# EAGLE board final_schematic (EAGLE 9.2.2), part 1 of 2
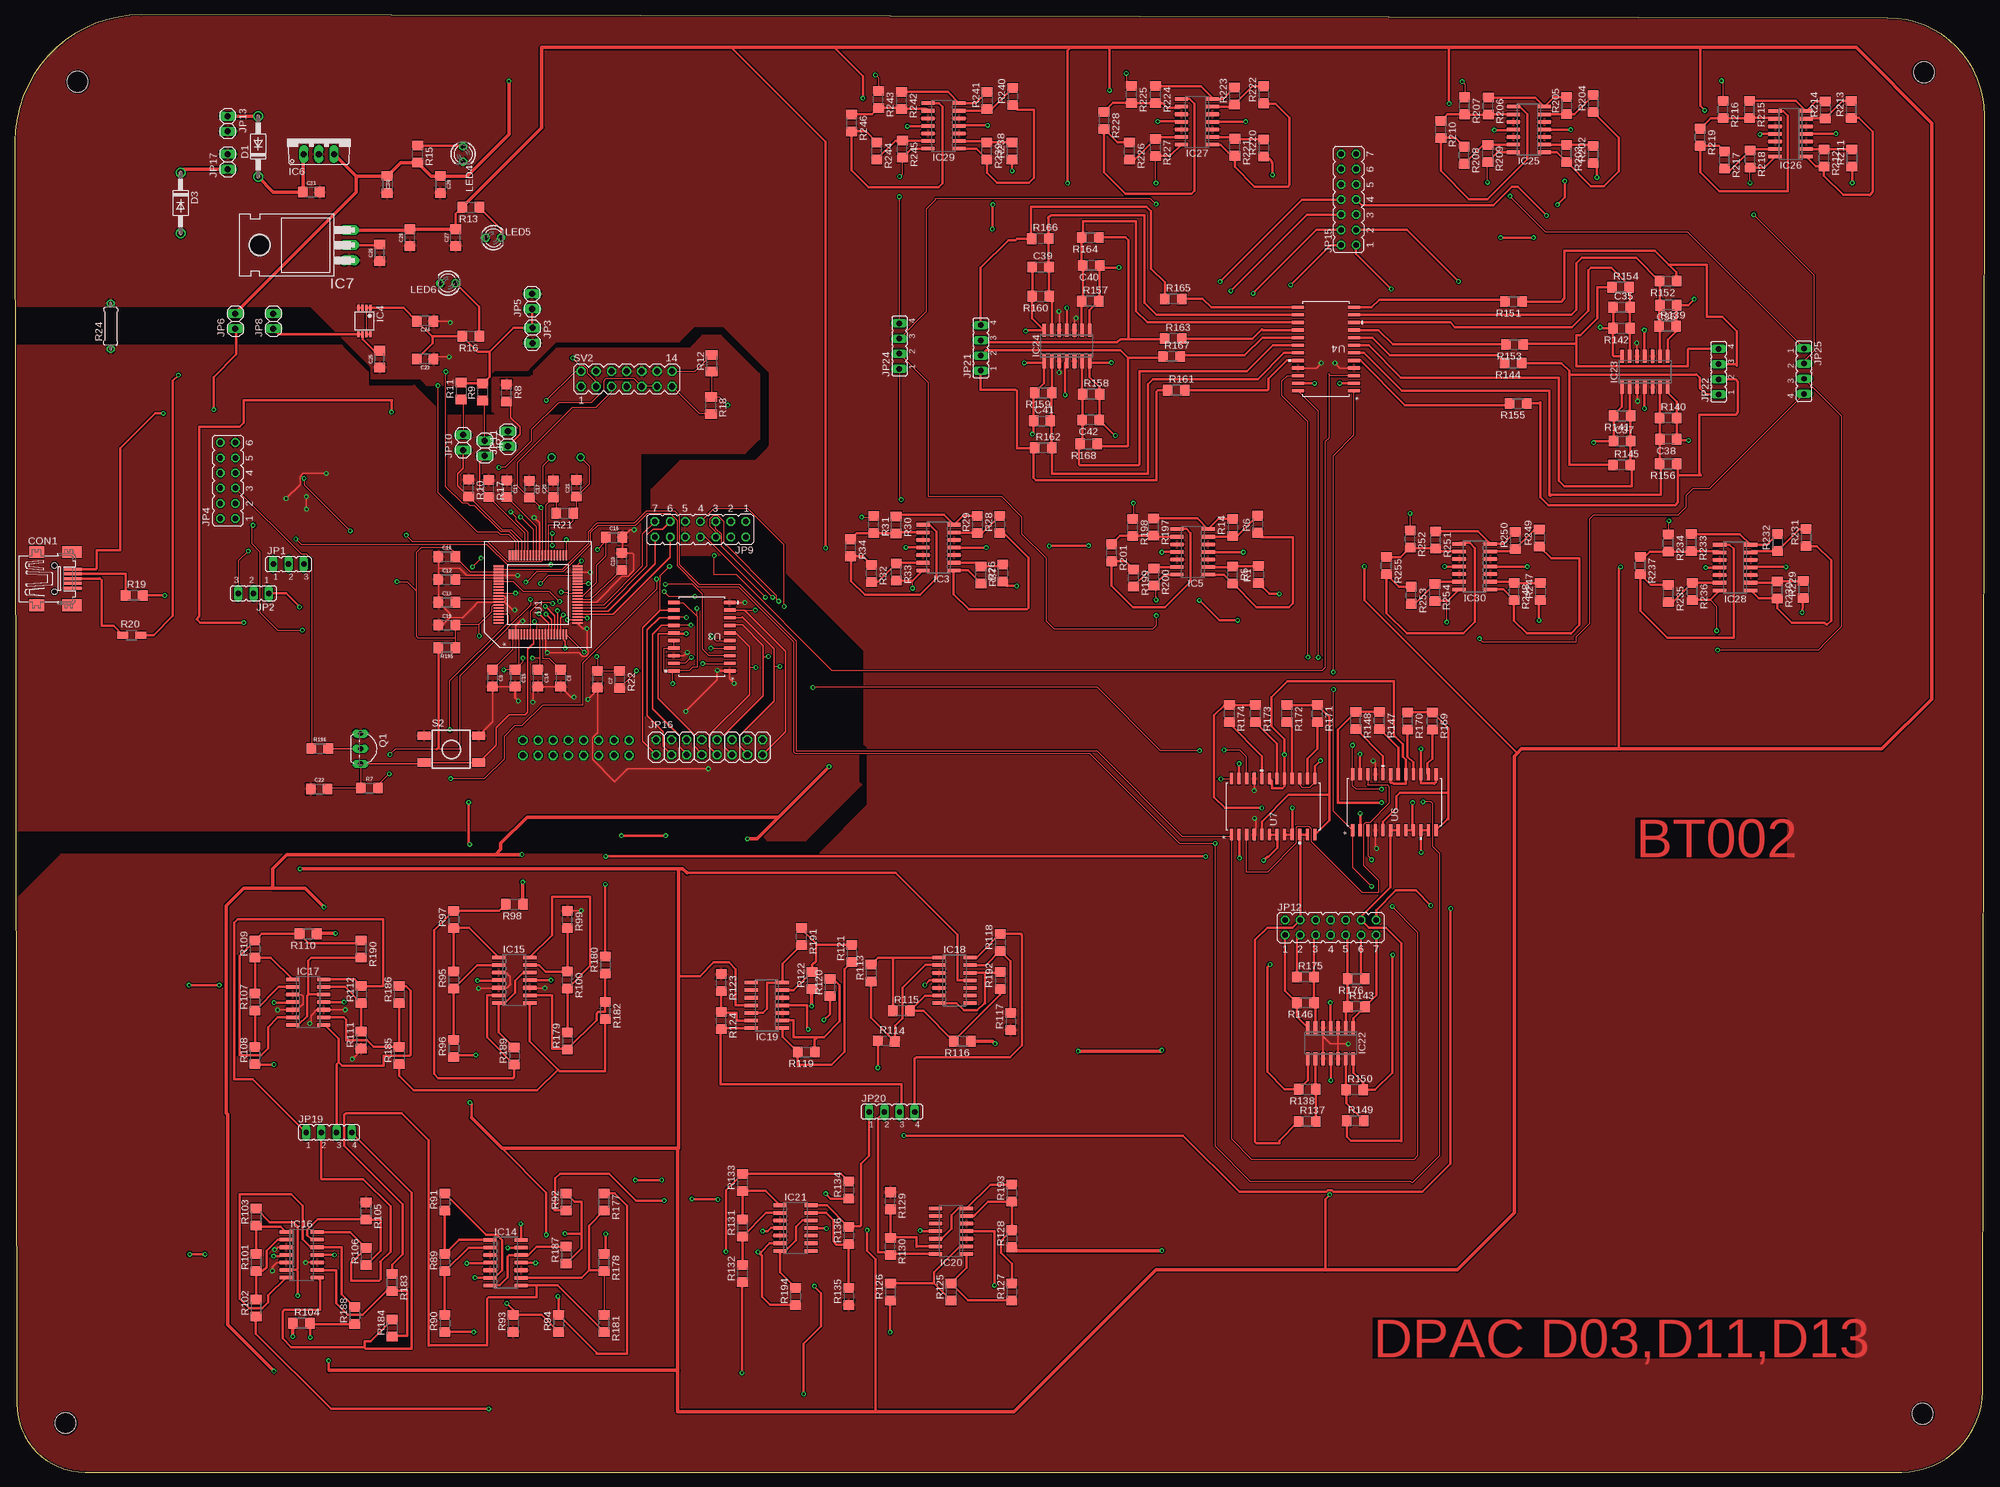
[diagram p3: board, top side]
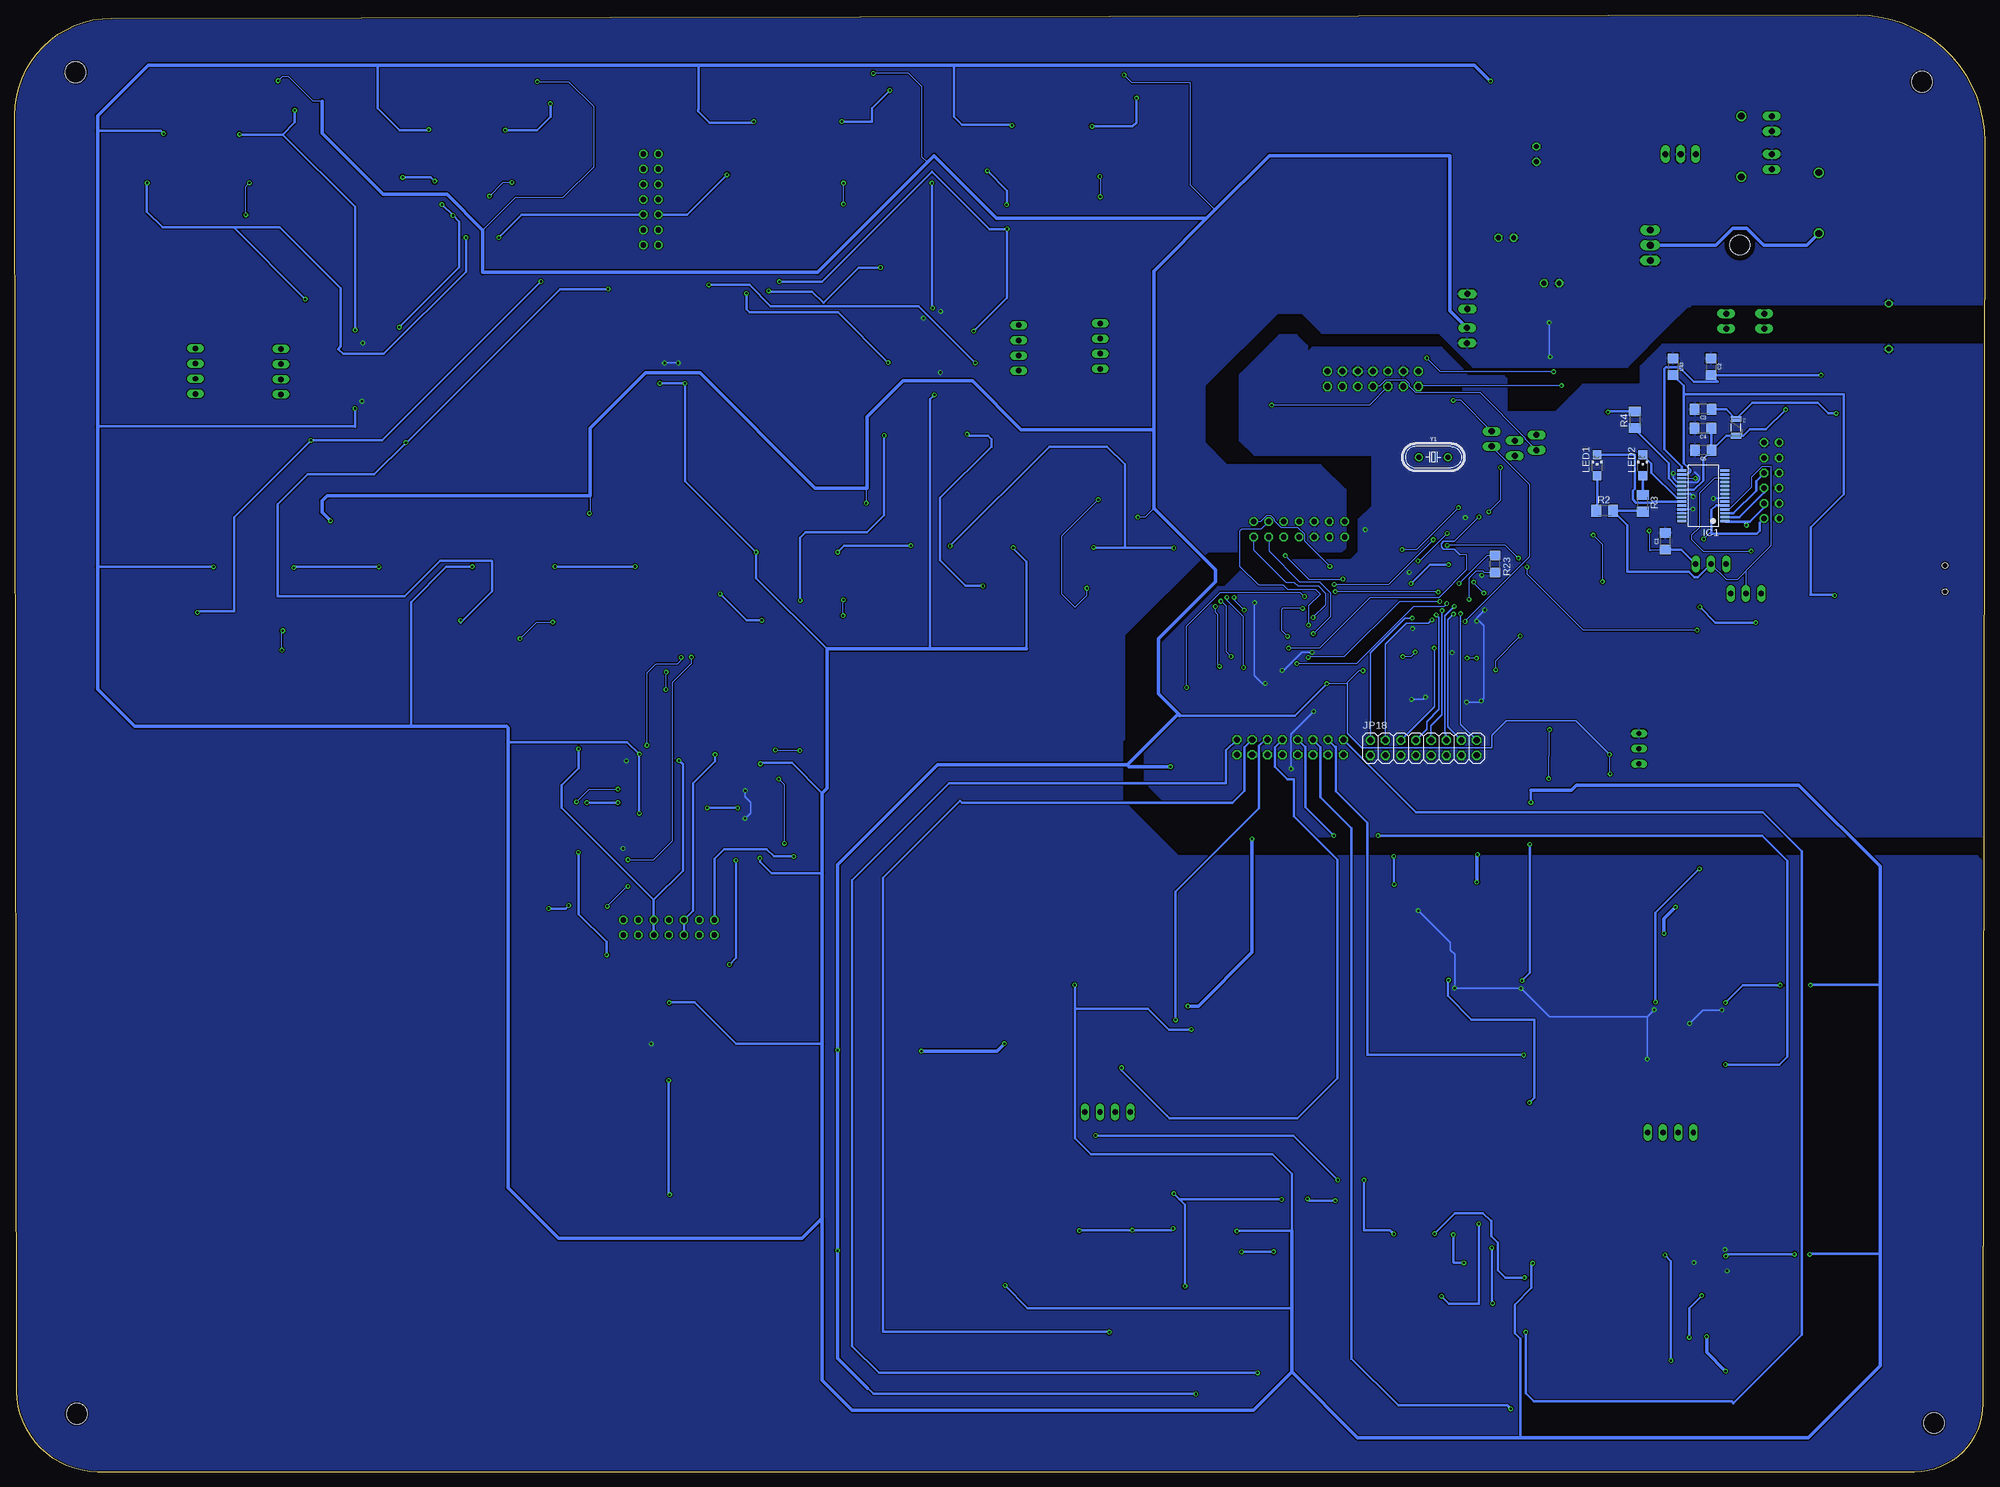
[diagram p4: board, bottom side, seen from below]

Size 329.54 x 243.72 mm. Coordinates in mm from the lower left corner, seen from the top.
Outline: 0,222.55 0.3,11.42 arc90 11.73,0 315.67,0 arc89 329.23,13.55 329.54,226.97 arc90 313.35,243.21 21.18,243.72 arc90 0,222.55
Copper layers (1*16): Top 0.035mm / dielectric 1.5mm / Bottom 0.035mm
Design rules "default *": minimum track width 8mil, minimum drill 0.35mm, track to track 7mil, track to pad 7mil, pad to pad 7mil, via to via 7mil, smd to smd 7mil, copper to edge 10mil, drill to drill 7mil, minimum pad ring 10mil, minimum via ring 8mil, stop-mask expansion 4mil, vias tented up to drill 0mil, thermal gap 10mil
Net classes: 0 default: width 0.203 mm; 1 power: width 0.254 mm
Holes 3.5 mm at 10.48,232.56 319.39,234.14 319.18,9.75 8.47,8.18

## Footprints (pad centres in the part's own frame; a part is rotated, then mirrored left to right if it is on the bottom)
1206 = smd 1.6 x 1.8: 1 -1.4,0; 2 1.4,0
C1206 = smd 1.6 x 1.8: 1 -1.4,0; 2 1.4,0
32005-201 = smd 3.1 x 0.5: 1 3,1.6; 2 3,0.8; 3 3,0; 4 3,-0.8; 5 3,-1.6 | smd 2.5 x 2: M1 -3,-4.45; M2 -3,4.45 | smd 3.3 x 2: M3 2.9,4.45; M4 2.9,-4.45 | hole 0.9: 0,2.2; 0,-2.2
DO41-10 = drill 1.118: A 5.08,0; C -5.08,0
PTC-1206 = smd 1 x 1.8: 1 -1.4,0; 2 1.4,0
SSOP28 = smd 0.4 x 1.5: 1 -4.225,-3.625; 2 -3.575,-3.625; 3 -2.925,-3.625; 4 -2.275,-3.625; 5 -1.625,-3.625; 6 -0.975,-3.625; 7 -0.325,-3.625; 8 0.325,-3.625; 9 0.975,-3.625; 10 1.625,-3.625; 11 2.275,-3.625; 12 2.925,-3.625; 13 3.575,-3.625; 14 4.225,-3.625; 15 4.225,3.625; 16 3.575,3.625; 17 2.925,3.625; 18 2.275,3.625; 19 1.625,3.625; 20 0.975,3.625; 21 0.325,3.625; 22 -0.325,3.625; 23 -0.975,3.625; 24 -1.625,3.625; 25 -2.275,3.625; 26 -2.925,3.625; 27 -3.575,3.625; 28 -4.225,3.625
SO14 = smd 0.6 x 2.2: 1 -3.81,-2.6; 2 -2.54,-2.6; 3 -1.27,-2.6; 4 0,-2.6; 5 1.27,-2.6; 6 2.54,-2.6; 7 3.81,-2.6; 8 3.81,2.6; 9 2.54,2.6; 10 1.27,2.6; 11 0,2.6; 12 -1.27,2.6; 13 -2.54,2.6; 14 -3.81,2.6
DGK_S-PDSO-G8 = smd 0.4 x 1: 1 -0.975,-2.2; 2 -0.325,-2.2; 3 0.325,-2.2; 4 0.975,-2.2; 5 0.975,2.2; 6 0.325,2.2; 7 -0.325,2.2; 8 -0.975,2.2
TO220V = drill 1.016 long: 1 -2.54,-2.54; 2 0,-2.54; 3 2.54,-2.54
TO220H = drill 1.118 long: 1 -2.54,-10.16; 2 0,-10.16; 3 2.54,-10.16 | hole 3.302: 0,4.826
JP2 = drill 0.914 long: 1 -2.54,0; 2 0,0; 3 2.54,0
1X02 = drill 1.016 long: 1 -1.27,0; 2 1.27,0
JP6Q = drill 0.914 octagon: 1 -6.35,-1.27; 2 -6.35,1.27; 3 -3.81,-1.27; 4 -3.81,1.27; 5 -1.27,-1.27; 6 -1.27,1.27; 7 1.27,-1.27; 8 1.27,1.27; 9 3.81,-1.27; 10 3.81,1.27; 11 6.35,-1.27; 12 6.35,1.27
JP7Q = drill 0.914 octagon: 1 -7.62,-1.27; 2 -7.62,1.27; 3 -5.08,-1.27; 4 -5.08,1.27; 5 -2.54,-1.27; 6 -2.54,1.27; 7 0,-1.27; 8 0,1.27; 9 2.54,-1.27; 10 2.54,1.27; 11 5.08,-1.27; 12 5.08,1.27; 13 7.62,-1.27; 14 7.62,1.27
2X08 = drill 1.016 octagon: 1 -8.89,-1.27; 2 -8.89,1.27; 3 -6.35,-1.27; 4 -6.35,1.27; 5 -3.81,-1.27; 6 -3.81,1.27; 7 -1.27,-1.27; 8 -1.27,1.27; 9 1.27,-1.27; 10 1.27,1.27; 11 3.81,-1.27; 12 3.81,1.27; 13 6.35,-1.27; 14 6.35,1.27; 15 8.89,-1.27; 16 8.89,1.27
JP4 = drill 0.914 long: 1 -3.81,0; 2 -1.27,0; 3 1.27,0; 4 3.81,0
CHIPLED_1206 = smd 1.5 x 1.5: A 0,-1.75; C 0,1.75
LED3MM = drill 0.813 octagon: A -1.27,0; K 1.27,0
TO92-EBC = drill 0.813 long: B 0,-1.27; C -2.54,-1.27; E 2.54,-1.27
R1206 = smd 1.6 x 1.803: 1 -1.422,0; 2 1.422,0
M1206 = smd 1.6 x 2: 1 -1.4,0; 2 1.4,0
R1206W = smd 1.8 x 1.2: 1 -1.499,0; 2 1.499,0
0207/7 = drill 0.813 octagon: 1 -3.81,0; 2 3.81,0
FSMJSMA = smd 1.397 x 2.108: P$1 0,0; P$2 0,-9.119; P$3 4.496,0; P$4 4.496,-9.119
MA07-2 = drill 1.016 octagon: 1 -7.62,-1.27; 2 -7.62,1.27; 3 -5.08,-1.27; 4 -5.08,1.27; 5 -2.54,-1.27; 6 -2.54,1.27; 7 0,-1.27; 8 0,1.27; 9 2.54,-1.27; 10 2.54,1.27; 11 5.08,-1.27; 12 5.08,1.27; 13 7.62,-1.27; 14 7.62,1.27
PN80 = smd 1.676 x 0.279: 1 -6.617,4.75; 2 -6.617,4.25; 3 -6.617,3.75; 4 -6.617,3.25; 5 -6.617,2.75; 6 -6.617,2.25; 7 -6.617,1.75; 8 -6.617,1.25; 9 -6.617,0.75; 10 -6.617,0.25; 11 -6.617,-0.25; 12 -6.617,-0.75; 13 -6.617,-1.25; 14 -6.617,-1.75; 15 -6.617,-2.25; 16 -6.617,-2.75; 17 -6.617,-3.25; 18 -6.617,-3.75; 19 -6.617,-4.25; 20 -6.617,-4.75; 41 6.617,-4.75; 42 6.617,-4.25; 43 6.617,-3.75; 44 6.617,-3.25; 45 6.617,-2.75; 46 6.617,-2.25; 47 6.617,-1.75; 48 6.617,-1.25; 49 6.617,-0.75; 50 6.617,-0.25; 51 6.617,0.25; 52 6.617,0.75; 53 6.617,1.25; 54 6.617,1.75; 55 6.617,2.25; 56 6.617,2.75; 57 6.617,3.25; 58 6.617,3.75; 59 6.617,4.25; 60 6.617,4.75 | smd 0.279 x 1.676: 21 -4.75,-6.617; 22 -4.25,-6.617; 23 -3.75,-6.617; 24 -3.25,-6.617; 25 -2.75,-6.617; 26 -2.25,-6.617; 27 -1.75,-6.617; 28 -1.25,-6.617; 29 -0.75,-6.617; 30 -0.25,-6.617; 31 0.25,-6.617; 32 0.75,-6.617; 33 1.25,-6.617; 34 1.75,-6.617; 35 2.25,-6.617; 36 2.75,-6.617; 37 3.25,-6.617; 38 3.75,-6.617; 39 4.25,-6.617; 40 4.75,-6.617; 61 4.75,6.617; 62 4.25,6.617; 63 3.75,6.617; 64 3.25,6.617; 65 2.75,6.617; 66 2.25,6.617; 67 1.75,6.617; 68 1.25,6.617; 69 0.75,6.617; 70 0.25,6.617; 71 -0.25,6.617; 72 -0.75,6.617; 73 -1.25,6.617; 74 -1.75,6.617; 75 -2.25,6.617; 76 -2.75,6.617; 77 -3.25,6.617; 78 -3.75,6.617; 79 -4.25,6.617; 80 -4.75,6.617
DW20 = smd 1.981 x 0.559: 1 -4.686,5.715; 2 -4.686,4.445; 3 -4.686,3.175; 4 -4.686,1.905; 5 -4.686,0.635; 6 -4.686,-0.635; 7 -4.686,-1.905; 8 -4.686,-3.175; 9 -4.686,-4.445; 10 -4.686,-5.715; 11 4.686,-5.715; 12 4.686,-4.445; 13 4.686,-3.175; 14 4.686,-1.905; 15 4.686,-0.635; 16 4.686,0.635; 17 4.686,1.905; 18 4.686,3.175; 19 4.686,4.445; 20 4.686,5.715
21-0042B_24 = smd 1.981 x 0.533: 1 -4.686,6.985; 2 -4.686,5.715; 3 -4.686,4.445; 4 -4.686,3.175; 5 -4.686,1.905; 6 -4.686,0.635; 7 -4.686,-0.635; 8 -4.686,-1.905; 9 -4.686,-3.175; 10 -4.686,-4.445; 11 -4.686,-5.715; 12 -4.686,-6.985; 13 4.686,-6.985; 14 4.686,-5.715; 15 4.686,-4.445; 16 4.686,-3.175; 17 4.686,-1.905; 18 4.686,-0.635; 19 4.686,0.635; 20 4.686,1.905; 21 4.686,3.175; 22 4.686,4.445; 23 4.686,5.715; 24 4.686,6.985
HC49U = drill 0.813: 1 -2.413,0; 2 2.413,0

## Placement (x,y rotation side)
C1  1.0uF  [1206]  53.39,155.68 90 bottom
C2  1.0uF  [1206]  45.77,184.89 270 bottom
C3  1.0uF  [1206]  47.08,177.79 180 bottom
C4  1.0uF  [1206]  47.11,174.58 180 bottom
C5  1.0uF  [1206]  47.04,170.92 180 bottom
C7  2.2uF  [1206]  97.46,132.61 270 top
C8  2.2uF  [1206]  91.32,132.79 270 top
C9  2.2uF  [1206]  79.89,132.79 270 top
C10  2.2uF  [1206]  101.54,152.3 90 top
C11  2.2uF  [1206]  82.32,164.46 270 top
C12  2.2uF  [1206]  72.27,149.3 0 top
C13  2.2uF  [1206]  72.27,145.49 0 top
C14  2.2uF  [1206]  87.51,132.79 270 top
C15  2.2uF  [1206]  83.7,132.79 270 top
C16  2.2uF  [1206]  100.24,156.35 0 top
C17  2.2uF  [1206]  86.06,164.39 270 top
C18  2.2uF  [1206]  72.27,153.11 0 top
C19  2.2uF  [1206]  72.27,141.68 0 top
C20  2.2uF  [1206]  90.07,164.45 90 top
C21  2.2uF  [1206]  93.95,164.54 90 top
C22  1.0uF  [1206]  50.9,114.27 0 top
C23  1.0uF  [1206]  68.63,186.16 180 top
C24  1.0uF  [1206]  68.63,192.51 180 top
C25  1.0uF  [1206]  61.01,186.16 90 top
C26  1.0uF  [1206]  61.01,203.94 90 top
C27  1.0uF  [1206]  73.71,206.48 90 top
C28  1.0uF  [1206]  66.09,206.48 90 top
C29  1.0uF  [1206]  71.17,215.37 270 top
C30  1.0uF  [1206]  62.28,215.37 270 top
C31  1.0uF  [1206]  49.58,214.1 0 top
C35  [C1206]  268.83,194.84 0 top
C36  [C1206]  276.63,195.18 180 top
C37  [C1206]  268.91,172.45 0 top
C38  [C1206]  276.64,172.75 180 top
C39  [C1206]  171.61,201.57 0 top
C40  [C1206]  180.07,201.8 180 top
C41  [C1206]  171.84,175.82 0 top
C42  [C1206]  179.99,175.99 180 top
C43  1.0uF  [1206]  52.12,184.89 270 bottom
CON1  UBC05V128-B0C04D  [32005-201]  6.62,149.44 0 top
D1  1N4004  [DO41-10]  40.69,221.72 90 top
D3  1N4004  [DO41-10]  27.72,212.27 270 top
F2  500mA  [PTC-1206]  41.59,174.74 270 bottom
IC1  FT232RL  [SSOP28]  47.04,163.3 90 bottom
IC3  TL084D  [SO14]  154.53,154.64 90 top
IC4  TPS77333  [DGK_S-PDSO-G8]  58.47,192.51 180 top
IC5  TL084D  [SO14]  197.03,153.91 90 top
IC6  7812TV  [TO220V]  50.85,222.99 0 top
IC7  [TO220H]  45.77,205.21 90 top
IC14  TL084D  [SO14]  82.08,35.01 270 top
IC15  TL084D  [SO14]  83.54,82.27 270 top
IC16  TL084D  [SO14]  47.96,36.32 270 top
IC17  TL084D  [SO14]  49.06,78.59 270 top
IC18  TL084D  [SO14]  157.22,82.23 270 top
IC19  TL084D  [SO14]  125.8,78.05 90 top
IC20  TL084D  [SO14]  156.63,40.29 90 top
IC21  TL084D  [SO14]  130.61,40.81 270 top
IC22  TL084D  [SO14]  220.12,71.74 180 top
IC23  TL084D  [SO14]  272.7,184.03 0 top
IC24  TL084D  [SO14]  176.01,188.37 0 top
IC25  TL084D  [SO14]  253.28,224.57 90 top
IC26  TL084D  [SO14]  297.1,223.83 90 top
IC27  TL084D  [SO14]  197.77,225.84 90 top
IC28  TL084D  [SO14]  287.81,151.29 90 top
IC29  TL084D  [SO14]  155.36,225.16 90 top
IC30  TL084D  [SO14]  244.23,151.45 90 top
JP1  power select  [JP2]  45.77,151.87 0 top
JP2  TEST  [JP2]  39.93,146.99 180 top
JP3  [1X02]  86.59,190.11 270 top
JP4  [JP6Q]  35.61,165.84 90 top
JP5  [1X02]  86.52,195.81 90 top
JP6  [1X02]  36.88,192.51 90 top
JP7  [1X02]  78.62,171.26 270 top
JP8  [1X02]  43.23,192.51 90 top
JP9  [JP7Q]  114.69,157.68 180 top
JP10  [1X02]  74.96,172.21 90 top
JP11  [1X02]  82.48,172.82 90 top
JP12  [JP7Q]  220.13,91.08 0 top
JP13  [1X02]  35.61,225.53 270 top
JP15  [JP7Q]  223.12,212.85 90 top
JP16  [2X08]  116.19,121.25 0 top
JP17  [1X02]  35.61,219.18 90 top
JP18  [2X08]  93.87,121.13 0 bottom
JP19  [JP4]  52.54,56.79 0 top
JP20  [JP4]  146.73,60.25 0 top
JP21  [JP4]  161.58,188.02 90 top
JP22  [JP4]  285.03,184.05 90 top
JP24  [JP4]  147.99,188.33 90 top
JP25  [JP4]  299.35,184.14 270 top
LED1  TXLED  [CHIPLED_1206]  64.82,168.38 0 bottom
LED2  RXLED  [CHIPLED_1206]  57.2,168.38 0 bottom
LED4  [LED3MM]  74.98,220.45 270 top
LED5  [LED3MM]  80.06,206.48 0 top
LED6  [LED3MM]  72.44,198.86 180 top
Q1  BC558B  [TO92-EBC]  59.09,120.99 270 top
R1  [R1206]  208.05,150.12 90 top
R2  270Ohm  [M1206]  63.55,160.76 0 bottom
R3  270Ohm  [M1206]  57.2,162.03 270 bottom
R4  10k  [M1206]  58.47,176 90 bottom
R5  [R1206]  203.75,150.05 270 top
R6  [R1206]  207.92,158.54 90 top
R7  [1206]  59.31,114.43 0 top
R8  [R1206]  82.23,180.48 270 top
R9  [R1206]  78.25,180.66 90 top
R10  [R1206]  75.89,164.57 270 top
R11  [R1206]  74.65,180.81 90 top
R12  4.7K  [M1206]  116.59,185.48 90 top
R13  [R1206]  76.25,211.56 180 top
R14  [R1206]  203.73,157.99 90 top
R15  [R1206]  67.36,220.45 270 top
R16  [R1206]  76.25,189.97 180 top
R17  [R1206]  79.28,164.48 270 top
R18  4.7K  [M1206]  116.47,178.4 270 top
R19  0  [R1206]  19.95,146.63 0 top
R20  0  [R1206W]  19.54,139.98 0 top
R21  [R1206]  91.99,160.36 180 top
R22  [R1206]  101.18,132.54 270 top
R23  [R1206]  81.88,151.85 270 bottom
R24  [0207/7]  16.01,191.65 90 top
R26  [R1206]  165.27,150.36 90 top
R27  [R1206]  161.64,150.05 270 top
R28  [R1206]  164.79,158.53 90 top
R29  [R1206]  161,158.5 90 top
R30  [R1206]  147.44,158.41 270 top
R31  [R1206]  143.7,158.46 270 top
R32  [R1206]  143.31,150.31 270 top
R33  [R1206]  147.45,150.54 270 top
R34  [R1206]  139.83,154.6 270 top
R89  [R1206]  71.92,35.01 90 top
R90  [R1206]  71.92,24.85 90 top
R91  [R1206]  71.92,45.17 90 top
R92  [R1206]  92.24,45.17 90 top
R93  [R1206]  83.35,24.85 90 top
R94  [R1206]  90.97,24.85 90 top
R95  [R1206]  73.38,82.27 90 top
R96  [R1206]  73.38,70.84 90 top
R97  [R1206]  73.38,92.43 90 top
R98  [R1206]  83.54,94.97 180 top
R99  [R1206]  92.43,92.43 270 top
R100  [R1206]  92.43,82.27 270 top
R101  [R1206]  40.34,35.05 90 top
R102  [R1206]  40.34,27.43 90 top
R103  [R1206]  40.34,42.67 90 top
R104  [R1206]  47.96,24.89 0 top
R105  [R1206]  58.75,43.66 270 top
R106  [R1206]  58.75,36.04 90 top
R107  [R1206]  40.17,78.59 90 top
R108  [R1206]  40.17,69.7 90 top
R109  [R1206]  40.17,87.48 90 top
R110  [R1206]  49.06,90.02 180 top
R111  [R1206]  57.95,72.24 90 top
R112  [R1206]  57.95,79.86 90 top
R113  [R1206]  143.25,83.5 90 top
R114  [R1206]  145.79,72.07 357.4 top
R115  [R1206]  148.33,77.15 0 top
R116  [R1206]  158.49,72.07 180 top
R117  [R1206]  166.59,75.34 90 top
R118  [R1206]  164.84,88.58 90 top
R119  [R1206]  132.38,70.27 180 top
R120  [R1206]  136.36,81.04 90 top
R121  [R1206]  140.02,86.73 90 top
R122  [R1206]  133.37,82.24 90 top
R123  [R1206]  118.18,81.86 270 top
R124  [R1206]  118.18,75.51 270 top
R125  [R1206]  156.63,30.13 90 top
R126  [R1206]  146.47,30.13 90 top
R127  [R1206]  166.79,30.13 90 top
R128  [R1206]  166.79,39.02 90 top
R129  [R1206]  146.47,45.37 270 top
R130  [R1206]  146.47,37.75 270 top
R131  [R1206]  121.72,40.81 90 top
R132  [R1206]  121.72,33.19 90 top
R133  [R1206]  121.72,48.43 90 top
R134  [R1206]  139.5,47.16 90 top
R135  [R1206]  139.5,29.38 90 top
R136  [R1206]  139.5,39.54 90 top
R137  [R1206]  216.2,58.65 0 top
R138  [R1206]  216.21,64.03 180 top
R139  [R1206]  276.51,191.65 0 top
R140  [R1206]  276.59,176.32 0 top
R141  [R1206]  268.87,176.7 180 top
R142  [R1206]  268.8,191.32 180 top
R143  [R1206]  224.44,77.85 0 top
R144  [R1206]  250.63,185.49 180 top
R145  [R1206]  268.81,168.44 0 top
R146  [R1206]  215.92,78.51 180 top
R147  [R1206]  228.3,125.71 270 top
R148  [R1206]  224.34,125.71 270 top
R149  [R1206]  224.25,58.74 0 top
R150  [R1206]  224.16,63.93 0 top
R151  [R1206]  250.73,195.78 180 top
R152  [R1206]  276.57,199.22 180 top
R153  [R1206]  250.89,188.6 180 top
R154  [R1206]  268.64,198.18 0 top
R155  [R1206]  251.49,178.75 180 top
R156  [R1206]  276.57,168.64 180 top
R157  [R1206]  179.89,195.82 0 top
R158  [R1206]  180.04,180.29 0 top
R159  [R1206]  172.03,180.55 180 top
R160  [R1206]  171.62,196.66 180 top
R161  [R1206]  194.3,180.96 0 top
R162  [R1206]  172.01,171.31 0 top
R163  [R1206]  193.76,189.6 0 top
R164  [R1206]  179.91,206.5 180 top
R165  [R1206]  193.8,196.21 0 top
R166  [R1206]  171.53,206.31 0.5 top
R167  [R1206]  193.53,186.6 0 top
R168  [R1206]  179.67,171.98 180 top
R169  [R1206]  237.15,125.65 270 top
R170  [R1206]  233,125.64 270 top
R171  [R1206]  217.9,126.85 270 top
R172  [R1206]  212.82,126.85 270 top
R173  [R1206]  207.55,126.85 270 top
R174  [R1206]  203.19,126.85 270 top
R175  [R1206]  215.92,82.81 0 top
R176  [R1206]  224.37,82.52 180 top
R177  [R1206]  98.59,45.17 270 top
R178  [R1206]  98.59,35.01 270 top
R179  [R1206]  92.43,72.11 90 top
R180  [R1206]  98.78,84.81 90 top
R181  [R1206]  98.59,24.85 270 top
R182  [R1206]  98.78,77.19 270 top
R183  [R1206]  63.12,31.71 270 top
R184  [R1206]  63.12,24.09 90 top
R185  [R1206]  64.3,69.7 90 top
R186  [R1206]  64.3,79.86 90 top
R187  [R1206]  92.24,36.28 90 top
R188  [R1206]  56.85,26.16 90 top
R189  [R1206]  83.54,69.57 90 top
R190  [R1206]  57.95,87.48 270 top
R191  [R1206]  131.59,89.58 270 top
R192  [R1206]  164.84,82.23 90 top
R193  [R1206]  166.79,46.64 90 top
R194  [R1206]  130.61,29.38 90 top
R195  [1206]  72.27,137.87 180 top
R196  [1206]  51.01,121.04 0 top
R197  [R1206]  190.5,158.05 270 top
R198  [R1206]  187,158 270 top
R199  [R1206]  187.15,149.58 270 top
R200  [R1206]  190.56,149.71 270 top
R201  [R1206]  183.49,153.76 270 top
R202  [R1206]  264.03,220.37 90 top
R203  [R1206]  259.63,220.56 270 top
R204  [R1206]  264.06,228.89 90 top
R205  [R1206]  259.63,228.55 90 top
R206  [R1206]  246.5,228.48 270 top
R207  [R1206]  242.57,228.53 270 top
R208  [R1206]  242.47,220.25 270 top
R209  [R1206]  246.42,220.55 270 top
R210  [R1206]  238.56,224.58 270 top
R211  [R1206]  307.32,219.83 90 top
R212  [R1206]  302.68,219.81 270 top
R213  [R1206]  307.22,227.92 90 top
R214  [R1206]  302.88,227.84 90 top
R215  [R1206]  290.21,227.92 270 top
R216  [R1206]  285.79,227.88 270 top
R217  [R1206]  286.04,219.45 270 top
R218  [R1206]  290.29,219.63 270 top
R219  [R1206]  281.94,223.27 270 top
R220  [R1206]  208.93,221.5 90 top
R221  [R1206]  204.13,221.6 270 top
R222  [R1206]  208.92,230.38 90 top
R223  [R1206]  204.05,230.2 90 top
R224  [R1206]  190.83,230.4 270 top
R225  [R1206]  186.81,230.45 270 top
R226  [R1206]  186.47,221 270 top
R227  [R1206]  190.81,221.55 270 top
R228  [R1206]  182.23,226.09 270 top
R229  [R1206]  299.23,147.64 90 top
R230  [R1206]  294.85,147.57 270 top
R231  [R1206]  299.67,156.29 90 top
R232  [R1206]  294.89,155.46 90 top
R233  [R1206]  280.5,155.46 270 top
R234  [R1206]  276.64,155.38 270 top
R235  [R1206]  276.65,146.98 270 top
R236  [R1206]  280.64,147.31 270 top
R237  [R1206]  271.93,151.6 270 top
R238  [R1206]  166.83,220.97 90 top
R239  [R1206]  162.61,221 270 top
R240  [R1206]  166.94,230.09 90 top
R241  [R1206]  162.64,229.45 90 top
R242  [R1206]  148.36,229.43 270 top
R243  [R1206]  144.47,229.62 270 top
R244  [R1206]  144.19,221 270 top
R245  [R1206]  148.48,221.29 270 top
R246  [R1206]  139.99,225.67 270 top
R247  [R1206]  255.24,147.3 90 top
R248  [R1206]  250.82,147.28 270 top
R249  [R1206]  255.04,156.22 90 top
R250  [R1206]  251.02,155.84 90 top
R251  [R1206]  237.71,155.93 270 top
R252  [R1206]  233.43,156.06 270 top
R253  [R1206]  233.62,146.66 270 top
R254  [R1206]  237.56,147.15 270 top
R255  [R1206]  229.47,151.6 270 top
S2  TP-1138K9-BE1125  [FSMJSMA]  77.58,123.16 270 top
SV2  JTAG  [MA07-2]  102.34,182.85 0 top
U1  TMS320F28069_PN_80  [PN80]  87.51,146.76 90 top
U3  TLV5610_DW_20  [DW20]  114.92,139.72 180 top
U4  MAX395EWG  [21-0042B_24]  219.36,187.84 180 top
U6  MAX395EWG  [21-0042B_24]  230.79,112.05 90 top
U7  MAX395EWG  [21-0042B_24]  210.52,111.31 90 top
Y1  [HC49U]  92.23,169.76 0 bottom

## Tracks (layer width: path | path; a pad name or v marks a point on that pad's centre or on a via)
3V3  (via drill 0.35)
  Top 0.203: v143.97,233.68 144.47,233.18 R243.1 | v185.94,233.97 185.94,232.74 R225.1 | v285.51,232.72 285.79,232.44 R216.1 | v242.14,232.57 242.57,232.14 R207.1 | v276.75,159.11 276.64,159 R234.1 | v233.42,160.35 233.43,160.33 R252.1 | v187.12,162.07 187.12,159.54 R198.1 | v141.66,159.72 144.16,159.72 144.2,159.76 144.07,159.89 R31.1 | U3.11 111.8,145.43 114.11,143.12 | 114.11,143.12 114.11,134.59 113.39,134.59 112.8,134 U3.20 110.04,133.81 | v110.04,131.87 110.04,133.81 | v62.75,120.02 62.72,120.05 63.59,120.92 70.57,120.92 74.38,120.92 74.38,133.13 82.34,141.09 82.34,141.1 82.5,141.26 82.51,141.26 86.26,145.01 v86.26,145.97 | v62.64,116.78 60.71,114.84 R7.2 | 114.11,143.12 v114.11,144.45 v114.11,144.46 | v116.6,139.79 117.31,139.08 U3.5 | U3.16 U3.17 110.16,137.74 108.54,137.74 108.53,137.72 108.53,133.99 109.87,133.99 110.04,133.81 | IC4.2 58.8,190.45 58.94,190.31 | R22.2 103.98,133.91 v103.98,134.03
  Top 0.406: 69.9,189.97 69.77,189.97 C24.2 65.03,194.71 IC4.1 IC4.2 | 69.9,189.97 R16.2 77.45,187.35 79.38,187.35 | C23.2 69.9,188.83 69.9,189.97 | IC4.7 58.94,190.31 IC4.8 | JP5.1 86.52,191.45 JP3.1 83.41,191.38 79.38,187.35 | 79.38,187.35 79.38,183.21 R9.2 74.79,182.09 R11.2 | v131.97,13.06 131.97,21.46 134.86,24.35 134.86,29.89 133.78,30.98 v133.78,31.08 | v135.65,46.57 136.49,45.74 R134.1 | v117.64,45.59 113.39,45.59 v113.27,45.71 | v108.64,45.4 103.93,45.4 99.41,49.92 91.18,49.92 90.38,49.11 90.38,44.37 90.03,44.02 90.3,43.75 R92.1 | R195.2 70.87,121.21 70.57,120.92
  Top 0.61: v136.21,117.97 127.74,109.51 | 127.74,109.51 85.66,109.51 81.29,105.14 81.29,104.14 80.43,103.28 | 43.15,97.66 43.15,100.94 45.5,103.28 80.43,103.28 | 43.15,97.66 43.15,97.62 38.25,97.62 35.38,94.75 35.38,60 35.58,59.81 35.58,24.64 v43.33,16.88 | v46.51,22.67 46.51,24.85 R104.1 | 43.15,97.66 48.54,97.66 v51.72,94.48 | v53.64,90.12 50.57,90.12 R110.1 | 80.43,103.28 84.82,103.28 v84.84,103.3 | v84.95,98.66 84.96,98.65 R98.1 | R128.1 167.35,37.04 v191.9,37.04 | R116.1 163.59,72.07 v164,71.67 | v177.89,70.4 191.74,70.4 v191.9,70.56 | 127.74,109.51 124.14,105.91 v122.54,105.91 | v133.29,77.92 133.29,80.74 R122.1
  Bottom 0.203: 128.75,211.11 128.76,211.12 132.9,215.26 132.9,232.36 142.65,232.36 v143.97,233.68 | 176.86,219.07 177.74,219.94 177.74,231.69 180.01,233.97 v185.94,233.97 | 278.18,229.3 279.66,229.3 283.72,233.36 284.87,233.36 v285.51,232.72 | 251.27,207.72 245.78,213.21 237.82,213.21 232.67,218.36 232.67,228.35 236.79,232.46 242.04,232.46 v242.14,232.57 | 276.93,163.29 276.75,163.11 | 233.29,163.29 233.29,160.47 v233.42,160.35 | 186.99,164.58 187.12,164.45 v187.12,162.07 | 138.98,161.23 140.49,159.72 v141.66,159.72 | 106.61,132.08 104.67,134.03 v103.98,134.03 | 106.61,131.99 106.74,131.87 v110.04,131.87 | v62.75,120.02 62.75,116.89 v62.64,116.78 | v114.11,144.46 117.44,144.46 117.64,144.27 117.64,140.82 v116.6,139.79 | R23.2 83.64,150.43 83.85,150.64 85.14,150.64 86.29,149.49 86.29,146 v86.26,145.97
  Bottom 0.254: v62.75,120.02 68.4,125.68 80,125.68 82.44,123.23 82.44,121.18 104.2,121.18 106.61,123.59 106.61,131.99 106.61,132.08
  Bottom 0.406: v110.04,131.87 115.37,126.54 134.73,126.54 | v131.97,13.06 185.91,13.06 187.27,14.41 | v133.78,31.08 133.78,44.7 134.71,45.63 | 134.71,45.63 v135.65,46.57 | 134.71,45.63 117.68,45.63 v117.64,45.59 | v113.27,45.71 112.97,45.4 v108.64,45.4
  Bottom 0.61: JP3.1 89.47,194.26 89.47,220.2 119.68,220.2 128.76,211.12 130.19,209.7 165.27,209.7 175.75,220.18 176.86,219.07 177.79,218.14 195.26,200.67 251.27,200.67 251.27,207.72 257.26,213.7 267.93,213.7 278.18,223.95 278.18,229.3 | 128.75,211.11 138.98,200.88 138.98,174.44 | 138.98,174.44 138.98,161.23 128.7,150.96 128.7,148.95 138.23,139.42 138.23,130.16 134.88,126.81 | 138.98,174.44 139.06,174.36 161.18,174.36 169.33,182.5 180.99,182.5 186.99,176.5 186.99,164.58 195.64,164.58 214.94,183.88 224.02,183.88 233.29,174.61 233.29,163.29 276.93,163.29 277.33,163.29 278.16,162.47 278.16,160.52 v276.75,159.11 | 134.88,126.81 134.73,126.66 134.73,126.54 | 134.88,126.81 143.42,118.26 | 186.87,14.02 187.27,14.41 191.9,19.05 v191.9,37.04 v191.9,70.56 191.9,101.56 175.2,118.26 143.42,118.26 | 143.42,118.26 143.13,117.97 v136.21,117.97 | v43.33,16.88 46.51,20.05 v46.51,22.67 | v51.72,94.48 53.64,92.56 v53.64,90.12 | v84.84,103.3 84.95,103.19 v84.95,98.66 | v164,71.67 165.27,70.4 v177.89,70.4 | v122.54,105.91 122.54,86.92 131.54,77.92 v133.29,77.92
3V3OUT  (via drill 0.35)
  Top 0.203: v48.37,166.22 48.37,165.17 v56.11,157.44
  Bottom 0.203: IC1.17 v48.38,166.22 v48.37,166.22 | v56.11,157.44 56.11,154.16 56.02,154.07 55.81,154.28 C1.1
  Bottom 0.406: C1.1 50.72,154.28 JP1.3
+12V  (via drill 0.35)
  Top 0.406: IC20.4 163.88,40.29 v163.88,31.22 | v162.73,225.25 158.04,225.25 IC29.4 | v205.92,225.88 200.4,225.88 IC27.4 | v260.3,224.55 255.9,224.55 IC25.4 | v304.66,223.88 299.75,223.88 IC26.4 | v296.3,151.4 290.52,151.4 IC28.4 | v253.01,151.43 253,151.45 IC30.4 | v205.54,153.85 199.69,153.85 IC5.4 | v162.52,154.62 157.14,154.62 IC3.4 | v272.65,177.9 272.65,181.37 IC23.4 | v175.7,180.16 175.7,185.46 IC24.4 | v204.79,118.47 204.79,116.01 U7.23 | v204.89,102.69 204.89,106.54 U7.2 | v225.06,120.07 225.06,116.75 U6.23 | v220.07,78.5 220.07,74.39 IC22.4 | v125.1,40.28 125.93,40.28 126.53,40.88 127.94,40.88 IC21.4 | v29.24,36.41 v31.8,36.41 | IC16.4 44.43,36.32 44.23,36.12 v43.29,36.12 | v75.61,34.92 79.39,34.92 IC14.4 | v29.12,81.43 v34.19,81.43 | v43.35,78.51 46.38,78.51 IC17.4 | v75.91,112.03 75.91,105.19 v76.1,105 | v77.39,82.2 80.87,82.2 IC15.4 | v152.26,81.46 153.03,82.23 IC18.4 | v221.64,182.11 224.04,182.11 U4.2 | v217.44,182.1 214.7,182.1 U4.23 | U6.2 v225.08,110.16 v225.07,110.16 | IC19.4 132.5,78.06 132.5,74.25 v132.72,74.04
  Top 0.61: v82.65,232.66 82.65,223.76 75.65,216.77 C29.1 69.62,216.77 R15.2 64.54,219.03 C30.1 57.07,216.77 | 57.07,216.77 IC6.3 | 57.07,216.77 57.07,214.06 36.83,193.81 36.87,193.78 JP6.2
  Bottom 0.406: 172.24,235.34 172.41,235.17 172.41,226.66 171.08,225.33 162.81,225.33 v162.73,225.25 | 215.18,235.34 215.18,227.94 215.28,227.83 215.28,227.63 213.32,225.67 206.12,225.67 v205.92,225.88 | 268.89,235.34 268.89,228.14 265.19,224.44 260.41,224.44 v260.3,224.55 | 315.69,224.34 305.11,224.34 v304.66,223.88 | v296.3,151.4 296.33,151.43 315.69,151.43 | 263.24,124.76 263.24,145.52 257.37,151.39 253.06,151.39 v253.01,151.43 | 193.69,137.69 205.54,149.53 v205.54,153.85 217.44,165.75 v217.44,182.1 v221.63,182.1 v221.64,182.11 | 160.32,137.69 160.32,152.28 162.54,154.5 162.54,154.59 v162.52,154.62 | 315.69,174.9 272.72,174.9 272.65,174.82 v272.65,177.9 | 176.44,137.69 176.44,179.43 v175.7,180.16 | 194.5,113.57 199.55,118.62 204.65,118.62 v204.79,118.47 | 194.5,100.16 202.95,100.16 204.89,102.1 v204.89,102.69 | 247.03,122.11 227.09,122.11 v225.06,120.07 225.07,120.06 v225.07,110.16 | 194.5,71.6 208.91,71.6 215.85,78.55 220.03,78.55 v220.07,78.5 | v125.1,40.28 125.02,40.36 115.91,40.36 115.91,49.92 119.15,53.16 149.51,53.16 152.22,55.87 152.2,55.89 152.2,77.51 | 115.91,27.44 160.1,27.44 v163.88,31.22 | 17.48,36.47 29.18,36.47 v29.24,36.41 | v31.8,36.41 42.99,36.41 v43.29,36.12 | 77.7,5.77 77.7,22.25 78.62,23.18 78.62,28.02 75.85,30.8 75.85,34.6 75.54,34.91 v75.6,34.91 v75.61,34.92 | 17.48,81.49 29.06,81.49 v29.12,81.43 | v34.19,81.43 40.44,81.43 v43.35,78.51 | 75.9,114.02 v75.9,112.04 v75.91,112.03 | v76.1,105 76.1,83.49 v77.39,82.2 | 152.2,77.51 152.2,81.41 v152.26,81.46 | 152.2,77.51 139.99,77.51 136.48,74 132.76,74 v132.72,74.04
  Bottom 0.61: v82.65,232.66 85.32,235.34 172.24,235.34 215.18,235.34 268.89,235.34 307.22,235.34 315.69,226.87 315.69,224.34 315.69,174.9 315.69,151.43 315.69,130.91 309.54,124.76 263.24,124.76 247.28,124.76 247.03,124.5 247.03,122.11 247.03,47.53 238.57,39.07 197.84,39.07 194.5,42.41 | 194.5,42.41 194.5,71.6 194.5,100.16 194.5,113.57 193.69,114.37 193.69,137.69 176.44,137.69 160.32,137.69 | 194.5,42.41 194.5,15.32 189.51,10.33 122.35,10.33 115.91,16.77 | 115.91,16.77 115.91,27.44 115.91,40.36 | 115.91,16.77 104.92,5.77 77.7,5.77 29.46,5.77 17.48,17.75 17.48,36.47 17.48,81.49 17.48,101.32 31.06,114.91 68.27,114.91 69.16,114.02 75.9,114.02
-12V  (via drill 0.35)
  Top 0.406: C27.2 73.71,207.9 73.71,210.44 R13.2 | 137.03,238.29 141.89,233.43 v141.89,229.81 | v149.33,225.1 152.69,225.1 IC29.11 | 183.1,238.29 183.1,231.18 v183.16,231.12 | v191.2,225.9 195.12,225.9 IC27.11 | 239.75,238.29 239.96,238.09 v239.96,228.89 | v247.52,224.46 250.58,224.46 IC25.11 | 281.98,238.29 281.98,228.52 v282.73,227.78 | v291.96,223.76 292.03,223.83 IC26.11 | v272.62,191 272.62,186.71 IC23.11 | 268.38,120.96 268.38,151.13 v268.65,151.4 | v282.87,151.28 285.19,151.28 IC28.11 | 251.37,120.26 225.78,145.85 v225.78,151.46 | v239.17,151.46 241.62,151.46 IC30.11 | 219.23,33.83 219.23,45.62 v220,46.39 | v220.17,65.52 220.17,69.09 IC22.11 | v55.08,78.61 IC17.11 | 76.39,59.26 76.39,61.55 v76.15,61.78 | v89.7,82.27 IC15.11 | 81.48,54.17 88.9,46.75 v88.9,39.69 | v87.11,34.98 84.71,34.98 IC14.11 | 52.56,17.01 52.46,17.11 v52.46,18.64 | v53.48,36.3 50.58,36.3 IC16.11 | 144,10.12 144,35.62 142.58,37.04 v142.58,40.47 | v151.45,40.36 151.52,40.29 IC20.11 | 111.04,82.93 114.61,82.93 116.92,85.24 119.45,85.24 120.56,84.13 120.56,78.05 IC19.11 | 112.49,100.22 147.34,100.22 157.69,89.87 157.69,82.29 157.75,82.23 IC18.11 | 119.85,238.29 135.64,222.5 v135.64,154.57 | v149.06,154.67 151.89,154.67 IC3.11 | 176.68,238.29 176.12,237.73 v176.12,215.6 | v175.99,194.71 175.99,190.98 IC24.11 | v173.08,154.9 179.59,154.9 v179.64,154.95 | v191.89,153.85 191.95,153.91 IC5.11 | v52.46,18.64 | IC21.11 133.28,40.74 v135.78,40.74
  Top 0.61: R13.2 88.13,224.86 88.13,238.29 119.85,238.29 137.03,238.29 176.68,238.29 183.1,238.29 239.75,238.29 281.98,238.29 308.04,238.29 320.68,225.65 320.68,129.27 312.37,120.96 268.38,120.96 252.08,120.96 251.37,120.26 250.85,119.73 250.85,43.37 241.3,33.83 219.23,33.83 190.88,33.83 167.17,10.12 144,10.12 110.87,10.12 110.87,17.01 | 110.87,54.17 111.04,54.17 111.04,82.93 111.04,100.9 111.05,100.9 | 76.39,59.26 81.48,54.17 110.87,54.17 | 111.05,100.9 111.74,100.9 112.43,100.22 112.49,100.22 | 111.05,100.9 v47.69,100.9 | 110.87,17.01 52.56,17.01 | 110.87,17.01 110.87,54.17 | IC7.3 66.32,207.75 66.19,207.88 C28.2 73.69,207.88 73.71,207.9
  Bottom 0.406: v141.89,229.81 141.94,229.76 141.94,225.69 142.53,225.1 v149.33,225.1 | v183.16,231.12 186.17,228.11 186.17,225.88 191.18,225.88 v191.2,225.9 | v239.96,228.89 239.96,226.66 242.15,224.46 v247.52,224.46 | v282.73,227.78 282.73,225.74 284.76,223.71 | 284.76,223.71 291.91,223.71 v291.96,223.76 | 284.76,223.71 272.66,211.6 272.66,191.02 272.64,191 v272.62,191 | v268.65,151.4 282.75,151.4 v282.87,151.28 | v225.78,151.46 v239.17,151.46 | v220,46.39 220.17,46.56 v220.17,65.52 | v47.69,100.9 55.08,93.51 v55.08,78.61 | v76.15,61.78 75.33,62.6 75.33,75.68 85.86,75.68 89.81,79.63 89.81,82.15 v89.7,82.27 | v88.9,39.69 88.9,35.1 88.78,34.98 v87.11,34.98 | v52.46,18.64 52.46,35.28 v53.48,36.3 | v135.78,40.74 136.04,40.47 v142.58,40.47 151.34,40.47 v151.45,40.36 | v135.64,154.57 143.8,154.57 | 143.8,154.57 148.96,154.57 v149.06,154.67 | v176.12,215.6 176.12,194.83 v175.99,194.71 | 143.8,154.57 143.8,168.54 146.8,171.54 156.45,171.54 v173.08,154.9 | v191.89,153.85 190.8,154.94 v179.65,154.94 v179.64,154.95
A1P
  Top 0.406: U4.8 227.13,189.74 230.08,186.79 247.91,186.79 R144.2
A1Q
  Top 0.406: IC23.2 270.16,176.82 R141.1 270.31,176.68 C37.2 270.31,168.52 | 270.31,168.52 R145.2 | U4.7 226.5,188.47 231.92,183.05 258.35,183.05 258.35,165.81 259.24,164.92 270.54,164.92 270.54,168.3 270.31,168.52
A3P
  Top 0.406: U4.5 225.1,185.93 232.59,178.45 249.77,178.45 R155.2
A3Q
  Top 0.406: 275.24,168.73 C38.2 275.17,172.82 R140.1 275.24,176.4 IC23.6 | 275.24,168.73 R156.2 | U4.6 225.7,187.2 232.07,180.83 256.75,180.83 256.75,163.42 256.87,163.3 257.06,163.48 275.39,163.48 275.39,168.57 275.24,168.73
A5P
  Top 0.406: U4.12 226.98,194.82 228.28,196.12 248.96,196.12 R151.2
A5Q
  Top 0.406: IC23.9 275.24,191.5 R139.1 275.09,195.05 C36.2 275.23,199.14 R152.2 271.28,203.09 262.15,203.09 261.22,202.15 261.22,194.38 260.39,193.55 U4.11
A7P
  Top 0.406: R153.2 230.51,188.6 228.09,191.02 228.08,191.01 U4.9
A7Q
  Top 0.406: IC23.13 270.16,191.26 R142.1 C35.2 | C35.2 | C35.2 270.23,198.02 R154.2 270.2,198.31 267.1,201.42 263.66,201.42 263.29,201.05 263.29,194.26 260.5,191.47 240.93,191.47 240.13,192.28 U4.10
ADC_IN1  (via drill 0.35)
  Top 0.203: JP25.4 283.46,164.45 280.72,164.45 279.59,163.33 279.59,161.41 278.24,160.06 264.08,160.06 263.41,159.39 263.41,141.85 261.16,139.61 261.16,138.82 245.62,138.82 v245.04,139.4 | v239.55,142.15 239.55,145.55 239.72,145.73
  Top 0.406: R254.2 239.72,145.73 IC30.14
  Bottom 0.203: v245.04,139.4 242.3,142.15 v239.55,142.15
ADC_IN2  (via drill 0.35)
  Top 0.203: JP25.3 305.55,176.67 305.55,141.41 302.29,138.15 302.29,138.03 301.73,137.47 v284.87,137.47 | v284.74,140.72 284.74,140.74 284.75,140.75 284.75,144.76 283.62,145.89
  Top 0.406: R236.2 283.62,145.89 IC28.14
  Bottom 0.203: v284.87,137.47 284.87,140.58 v284.74,140.72
ADC_IN3  (via drill 0.35)
  Top 0.203: JP25.2 299.35,185.84 301.05,187.54 301.05,200.18 v290.93,210.3 | v290.31,215.64 290.29,215.65 R218.2
  Top 0.406: R218.2 292.68,218.21 IC26.14
  Bottom 0.203: v290.93,210.3 290.93,215.02 v290.31,215.64
ADC_IN4  (via drill 0.35)
  Top 0.203: JP25.1 279.92,207.38 256.17,207.38 v250.13,213.43 | v246.36,215.71 246.36,219.06 R209.2
  Top 0.406: R209.2 248.05,220.76 IC25.14
  Bottom 0.203: v250.13,213.43 247.85,215.71 v246.36,215.71
ADC_IN5  (via drill 0.35)
  Top 0.203: v150.2,147.83 150.2,149.1 150.22,149.11 | JP24.1 147.99,162.94 v148.3,162.64
  Top 0.406: R33.2 150.22,149.11 IC3.14
  Bottom 0.203: v150.2,147.83 150.2,146.63 152.16,144.67 154.4,146.91 154.4,156.53 v148.3,162.64
ADC_IN6  (via drill 0.35)
  Top 0.203: JP24.2 152.78,182.27 152.78,163.18 165.05,163.18 168.42,159.8 168.42,156.97 172.47,152.93 172.47,142.4 173.82,141.05 190.41,141.05 190.98,141.62 v190.98,143.26 | v190.92,145.87 190.92,147.93 R200.2
  Top 0.406: R200.2 192.36,150.1 IC5.14
  Bottom 0.203: v190.98,143.26 190.98,145.81 v190.92,145.87
ADC_IN7  (via drill 0.35)
  Top 0.203: JP24.3 152.54,194.15 152.54,211.32 154,212.77 154,213.1 189.92,213.1 v190.93,212.08 | v190.91,215.59 190.81,215.69 R227.2
  Top 0.406: IC27.14 193.27,220.13 R227.2
  Bottom 0.203: v190.93,212.08 190.93,215.56 v190.91,215.59
ADC_IN8  (via drill 0.35)
  Top 0.203: v148.02,216.7 148.48,217.17 R245.2 | JP24.4 147.99,213.28 v147.96,213.32
  Top 0.406: R245.2 149.97,221.35 IC29.14
  Bottom 0.203: v147.96,213.32 147.96,216.65 v148.02,216.7
ADC_ORG1  (via drill 0.35)
  Top 0.254: U1.19 91.81,140.09 91.81,139.18 92.06,138.93 v92.06,137.81
  Bottom 0.254: JP18.6 92.06,128.02 v92.06,137.81
ADC_ORG2  (via drill 0.35)
  Top 0.254: v91.73,143.37 91.26,142.89 U1.18
  Bottom 0.254: JP18.8 93.33,124.2 93.33,125.52 91.26,127.59 91.26,142.9 v91.73,143.37
ADC_ORG3  (via drill 0.35)
  Top 0.254: v90.79,144.08 90.79,140.18 U1.17
  Bottom 0.254: JP18.10 92.6,124.85 90.79,126.66 v90.79,144.08
ADC_ORG4  (via drill 0.35)
  Top 0.254: v88.72,144.81 88.77,144.81 90.31,143.27 90.31,140.2 U1.16
  Bottom 0.254: JP18.12 90.06,123.24 90.32,123.51 90.32,143.21 v88.72,144.81
ADC_ORG5  (via drill 0.35)
  Top 0.254: v88.85,143.49 89.76,142.59 U1.15
  Bottom 0.254: JP18.14 89.76,124.64 89.76,142.59 v88.85,143.49
ADC_ORG6  (via drill 0.35)
  Top 0.254: v87.7,143.57 89.26,142.01 U1.14
  Bottom 0.254: JP18.16 87.7,125.12 v87.7,143.57
ADC_ORG7  (via drill 0.35)
  Top 0.254: v92.45,142.53 94.1,142.53 U1.22
  Bottom 0.254: JP18.4 100.22,138.48 96.74,141.96 94.16,141.96 94.13,141.96 93.02,141.96 v92.45,142.53
ADC_ORG8  (via drill 0.35)
  Top 0.254: v95.74,142.83 95.58,142.98 94.15,142.98 U1.23
  Bottom 0.254: JP18.2 102.76,137.01 96.99,142.77 95.79,142.77 v95.74,142.83
B1P
  Top 0.406: R161.2 209.59,180.96 209.71,181.08 209.71,182.84 212.8,185.93 U4.20
B1Q
  Top 0.406: IC24.2 173.47,180.56 R159.1 173.46,176.04 C41.2 173.44,175.63 R162.2 173.5,171.25 173.5,166.95 189.55,166.95 189.55,181.97 190.38,182.8 207.94,182.8 212.34,187.2 U4.19
B3P
  Top 0.406: U4.17 208.7,189.74 205.73,186.77 195.12,186.77 R167.2
B3Q
  Top 0.406: IC24.6 178.55,180.36 R158.1 178.62,176.02 C42.2 178.59,172.33 R168.2 178.03,171.76 178.03,168.6 178.2,168.43 188,168.43 188.12,168.55 188.12,184.12 206.1,184.12 210.45,188.47 U4.18
B5P
  Top 0.406: R163.2 207.07,189.6 208.65,191.17 208.8,191.01 U4.16
B5Q
  Top 0.406: 178.49,201.99 R164.2 178.67,206.69 178.67,209.22 187.58,209.22 187.58,194.14 189.44,192.28 U4.15 | C40.2 178.67,196.03 R157.1 178.47,191.05 IC24.9
  Top 0.61: C40.2 178.49,201.99
B7P
  Top 0.406: U4.13 200.17,194.82 198.72,196.28 195.29,196.28 R165.2
B7Q
  Top 0.203: R166.2
  Top 0.406: IC24.13 173.47,196.23 R160.1 173.04,201.53 C39.2 172.95,201.62 R166.2 172.95,209.68 172.85,209.78 173.32,210.26 188.95,210.26 188.95,195.58 190.98,193.55 U4.14
C1Q
  Top 0.406: R170.1 237.14,127.06 R169.1 239.83,124.39 239.83,113.59 | U6.12 239.63,109.22 239.83,109.22 239.83,113.59 | U6.5 228.89,108.81 231.14,111.06 231.14,113 231.73,113.59 239.83,113.59
C3Q  (via drill 0.35)
  Top 0.406: R147.1 R148.1 221.33,124.12 221.33,111.96 v228.63,111.96 | U6.8 U6.9 233.85,107.49 v233.85,111.95
  Bottom 0.406: v228.63,111.96 233.79,111.96 233.81,111.98 233.82,111.98 v233.85,111.95
C5P
  Top 0.406: R169.2 237.15,119.34 236.34,118.53 236.34,116.9 U6.14
C5Q  (via drill 0.35)
  Top 0.203: U7.15 214.96,114.95 215.35,114.57 216.68,114.57 217.5,115.39 U7.13
  Top 0.406: IC22.2 222.66,77.49 222.95,77.77 | 222.95,77.77 R143.1 | 222.95,77.77 R176.2 222.95,89.53 JP12.9 | U6.13 237.78,115.41 237.49,115.12 237.44,115.17 235.25,115.17 235.24,115.18 U6.15 v235.24,120.97 v235.24,120.96 | v218.44,119 217.5,118.07 U7.13
  Bottom 0.406: 222.67,95.71 JP12.10 JP12.9 | 222.67,95.71 217.79,100.59 217.79,118.35 v218.44,119 | v235.24,120.96 235.24,117.69 238.04,114.89 238.04,111.08 222.67,95.71
C6P
  Top 0.406: R170.2 233,119.65 233.97,118.69 U6.16
C7P
  Top 0.406: R147.2 231.43,121.15 U6.18
C7Q  (via drill 0.35)
  Top 0.203: R146.1 217.34,78.23
  Top 0.406: IC22.6 217.58,77.76 217.69,77.87 217.34,78.23 R175.2 217.34,89.55 JP12.5 | U6.19 230.16,115.39 230.22,115.32 230.49,115.32 230.68,115.14 232.68,115.14 232.7,115.16 U6.17 232.7,119.13 232.2,119.63 232.2,121.77 230.7,123.27 230.7,132.22 230.68,132.23 212.92,132.23 210.25,129.57 210.25,125.3 210.2,125.25 210.25,125.2 210.25,124.7 212.4,122.56 v212.4,120 212.4,116.02 U7.17 212.42,114.7 212.08,114.36 210.28,114.36 210.28,115.6 U7.19
  Bottom 0.406: v212.4,120 212.4,118.88 216.09,115.19 216.09,93.84 JP12.6 JP12.5
C8P
  Top 0.406: R148.2 228.89,119.74 U6.20
CBUS4  (via drill 0.35)
  Top 0.203: v39.05,154.04 37.39,152.39 JP2.3
  Bottom 0.203: IC1.12 45.21,166.22 47.72,163.71 47.72,157.97 49.03,156.66 49.03,155.99 47.08,154.04 v39.05,154.04
CHAN_A  (via drill 0.35)
  Top 0.203: v109.53,151.49 107.98,149.94 107.98,149.67 108.01,149.64 108.01,149.1 107.98,149.07 107.98,144.16
  Top 0.254: JP16.1 105.04,122.23 105.04,141.22 107.98,144.16 U3.12
  Bottom 0.203: v109.53,151.49 113.7,155.66 113.7,156.82 114.84,157.96 117.64,157.96 118.78,159.1 118.78,159.36 119.36,159.94 120.18,159.94 121.17,158.95 JP9.1
CHAN_A1  (via drill 0.35)
  Top 0.406: v76.77,23.38 76.72,23.43 R90.1
  Bottom 0.406: JP16.2 95.13,110.35 37.1,110.35 30.6,103.85 30.6,22.94 42,11.54 42.3,11.84 75.41,11.84 75.44,11.81 76.77,13.14 v76.77,23.38
CHAN_B  (via drill 0.35)
  Top 0.203: v112.36,142.94 110.17,142.94 110.12,142.89
  Top 0.254: JP16.3 108.44,121.37 108.44,123.86 105.78,126.52 105.78,140.86 107.82,142.89 110.12,142.89 U3.13
  Bottom 0.203: JP9.2 122.31,154.23 116.93,148.84 115.55,148.84 114.91,148.21 111.47,148.21 110.29,147.02 110.29,145.01 v112.36,142.94
CHAN_B1  (via drill 0.35)
  Top 0.406: v77.11,69.75 73.72,69.75 R96.1
  Bottom 0.406: JP16.4 108.68,121.35 108.52,121.35 108.52,113.85 103.29,108.62 103.29,69.83 77.4,69.83 77.11,69.54 | 77.05,69.47 77.11,69.54 | 77.11,69.54 v77.11,69.75
CHAN_C  (via drill 0.35)
  Top 0.203: v113.09,141.66 110.27,141.66 U3.14
  Top 0.254: JP16.5 112.38,120.1 111.2,121.28 111.2,123.18 106.7,127.68 106.7,140.13 108.2,141.62 U3.14
  Bottom 0.203: JP9.3 121.05,157.68 124.3,157.68 124.63,157.35 124.63,151.53 121.5,148.4 117.43,148.4 116.65,147.62 111.93,147.62 111.16,146.85 113.09,144.92 v113.09,141.66
CHAN_C1  (via drill 0.35)
  Top 0.406: v79.27,10.57 52.88,10.57 40.31,23.14 40.31,25.98 R102.1
  Bottom 0.406: JP16.6 111.09,121.22 111.09,116.36 111.09,112.87 105.9,107.68 105.9,18.95 98.09,11.14 79.87,11.14 79.35,10.62 79.31,10.62 v79.27,10.57
CHAN_D  (via drill 0.35)
  Top 0.203: 110.27,140.23 110.25,140.21 110.23,140.23 U3.15
  Top 0.254: JP16.7 114.92,120.14 113.59,121.47 113.59,123.43 107.61,129.4 107.61,140.21 110.25,140.21
  Top 0.406: U3.15 110.36,140.23 v112.29,140.23
  Bottom 0.203: JP9.4 119.77,154.06 114.61,148.9 111.28,148.9 109.44,147.06 109.44,143.08 v112.29,140.23
CHAN_D1  (via drill 0.35)
  Top 0.406: v108.87,106.44 101.49,106.44 v101.48,106.43 | v43.37,68.16 40.29,68.16 R108.1
  Bottom 0.406: JP16.8 113.7,121.29 113.61,121.29 113.61,111.17 v108.87,106.44 | v101.48,106.43 37.17,106.43 33.01,102.27 33.01,69.49 34.33,68.16 v43.37,68.16
CHAN_E  (via drill 0.35)
  Top 0.203: 122.91,134.58 v123.98,134.58 | v126.77,146.32 118.22,154.86 118.22,156.82 117.23,157.82 JP9.5
  Top 0.254: JP16.9 116.22,121.22 116.16,121.22 116.16,123.3 122.91,130.05 122.91,134.58 122.91,138.07 120.52,140.46 120.41,140.35 U3.6
  Bottom 0.203: v123.98,134.58 123.98,143.05 126.77,145.84 v126.77,146.32
CHAN_E1  (via drill 0.35)
  Top 0.406: v144.4,67.62 144.4,72.11 R114.1
  Bottom 0.406: JP16.10 118.76,121.21 118.76,117.98 116.64,115.86 115.53,115.86 115.53,109.69 108.27,102.43 108.27,65.9 114.98,59.19 136.36,59.19 136.75,59.58 144.4,67.23 v144.4,67.62
CHAN_F  (via drill 0.35)
  Top 0.203: 125.19,136.32 125.27,136.41 v126.06,136.41 | v127.78,145.65 127.43,146.01 127.43,146.59 118.61,155.41 118.61,158.98 117.64,159.94 116.82,159.94 116.24,159.36 116.24,158.27 117.23,157.28 JP9.6
  Top 0.254: JP16.11 118.74,121.24 118.74,123.43 125.19,129.88 125.19,136.32 125.19,138.24 121.74,141.68 119.67,141.68 U3.7
  Bottom 0.203: v126.06,136.41 126.82,137.17 126.82,144.78 | 126.82,144.78 126.82,144.9 | 126.82,144.78 127.69,145.65 v127.78,145.65
CHAN_F1  (via drill 0.35)
  Top 0.406: R120.1 136.36,76.61 v135.37,75.62
  Bottom 0.406: JP16.12 120.33,122.52 121.37,121.47 121.37,111.06 135.37,97.06 v135.37,75.62
CHAN_G  (via drill 0.35)
  Top 0.203: 127.04,134.62 127.17,134.75 v128.01,134.75 | v128.69,144.78 128.69,155.12 122.68,161.14 116.88,161.14 JP9.7
  Top 0.254: JP16.13 122.54,120.18 121.25,121.47 121.25,123.18 127.04,128.97 127.04,134.62 127.04,137.67 121.68,143.03 121.54,142.89 U3.8
  Bottom 0.203: v128.01,134.75 128.28,135.02 128.28,143.39 128.69,143.8 v128.69,144.78
CHAN_G1  (via drill 0.35)
  Top 0.406: v146.43,23.39 146.43,28.67 R126.1
  Bottom 0.406: JP16.14 123.8,121.26 123.8,113.98 125.8,111.97 171.12,111.97 171.4,112.26 184.27,99.39 184.27,23.45 146.54,23.45 146.43,23.34 v146.43,23.39
CHAN_H  (via drill 0.35)
  Top 0.203: U3.9 123.86,144.16 v123.87,144.18 | v125.56,146.32 115.46,156.41 JP9.8
  Top 0.254: U3.9 122.08,144.16 128.93,137.32 128.93,123.82 JP16.15
  Bottom 0.203: v123.87,144.18 125.56,145.87 v125.56,146.32
CHAN_H1  (via drill 0.35)
  Top 0.406: v121.64,16.57 121.64,31.69 R132.1
  Bottom 0.406: JP16.16 126.89,120.7 126.89,115.19 173.26,115.19 189.45,99 189.45,21.07 184.95,16.57 v121.64,16.57
COMP2
  Top 0.203: U1.55 85.26,157.11 79.31,163.06 R17.2
  Top 0.254: R17.2 77.73,164.61 77.73,168.74 77.68,168.79 78.62,169.73 JP7.2
CS_SW  (via drill 0.35)
  Top 0.203: U1.70 83.7,147.01 83.75,147.06 83.75,147.03 v83.77,147.01 | v201.74,115.92 203.46,115.92 U7.24 | v235.58,112.1 236.89,112.1 237.21,111.78 237.21,104.63 238.42,103.42 238.42,53.01 233.79,48.39 233.51,48.66 206.65,48.66 200.78,54.54 v200.78,105.16 194.85,105.16 179.78,120.23 130.51,120.23 130.29,120.45 130.29,138.89 121.07,148.1 114.31,148.1 110.76,151.65 110.76,159.23 109.65,160.35 109.62,160.35 109.56,160.41 105.84,160.41 103.81,158.38 97.56,158.38 96.34,157.16 96.34,155.17 91.8,150.63 87.35,150.63 85.57,148.86 v85.46,148.86 | v228.65,114.22 224.42,114.22 223.81,114.83 U6.24 223.81,121.54 v223.79,121.57 | v218.08,136.27 218.08,177.45 U4.24
  Bottom 0.203: v83.77,147.01 85.46,148.7 v85.46,148.86 | v200.78,105.16 200.78,114.96 v201.74,115.92 | v235.58,112.1 233.47,114.22 v228.65,114.22 | v223.79,121.57 223.79,133.73 222.28,135.23 218.67,135.23 218.08,135.82 v218.08,136.27
D1Q
  Top 0.406: R172.1 R171.1 219.91,126.26 219.91,113.18 | 219.91,113.18 219.91,109.03 U7.12 | U7.5 208.61,108.8 213.07,113.26 219.83,113.26 219.91,113.18
D3Q  (via drill 0.35)
  Top 0.406: R173.1 R174.1 202.34,128.27 200.63,126.56 200.63,112.89 202.44,111.08 v208.62,111.08 | U7.8 213.66,106.63 | 213.66,106.63 U7.9 | v213.71,111.08 213.71,106.68 213.66,106.63
  Bottom 0.406: v213.71,111.08 208.78,111.08 208.65,110.95 208.62,110.98 v208.62,111.08
D5P
  Top 0.406: R171.2 217.9,120.99 216.23,119.31 U7.14
D6P
  Top 0.406: R172.2 213.69,124.56 U7.16
D7P
  Top 0.406: R173.2 211.15,121.82 U7.18
D8P
  Top 0.406: R174.2 203.19,125.23 208.66,119.76 208.66,116.05 U7.20
DGND  (via drill 0.35)
  Top 0.254: v86.66,128.79 86.66,130.54 C14.2 C8.2 93.09,129.62 v93.55,129.62 | v84.22,128.97 83.67,129.53 | v84.95,142.33 84.55,142.33 83.76,141.54 U1.3 | v84.12,149.98 84.09,150.01 U1.64 75.56,150.01 74.42,151.16 70.87,151.16 | 76.95,144.95 76.95,145.08 77.38,145.51 U1.73 80.94,145.57 81.85,145.57 | 76.95,144.95 76.95,144.82 | U1.50 87.76,158.76 v86.86,159.65 | 76.95,144.95 74.89,142.89 72.74,142.89 | 71.65,141.8 72.74,142.89 | 81.85,145.57 82.03,145.75 82.03,146.28 81.85,146.46 80.94,146.46 U1.71 | 81.85,145.57 83.23,144.19 v83.62,144.19 | v95.89,129.25 97.46,130.82 C7.2 97.46,123.69 96.61,122.84 96.61,119.22 100.34,115.49 102.48,117.64 v116.05,117.64 | U1.38 96.24,150.51 v96.25,150.5 | U1.21 95.07,141.06 v95.72,141.06 95.72,137.64 95.93,137.43 95.93,136.87 95.53,136.47 94.97,136.47 94.38,137.06 v89.07,137.06 | U1.13 88.76,137.37 v89.07,137.06 | v89.07,137.06 | v48.76,163.16 48.76,161.1 v48.79,161.07 | v45.36,162.84 47.69,165.17 47.69,166.5 48.22,167.04 v52.09,167.04 | U3.10 v122.15,145.43 | v120.33,131.93 119.61,132.66 U3.1 | U3.18 111.91,136.54 112.48,137.11 v112.49,137.11 | 70.87,151.16 C18.1 | 70.87,151.16 C12.1 C13.1 72.74,143.62 72.74,142.89 | C15.2 C9.2 79.89,125.47 S2.P$1 | v112.24,127.22 117.51,132.49 v117.51,134.11 | U1.28 97.32,145.51 101.6,149.79 102.57,149.79 103.49,150.72 103.49,153.5 103.29,153.7 C10.2 101.65,153.81 101.65,155.78 | C16.2 102.91,157.61 v103.61,157.61
  Top 0.406: U3.1 117.61,134 v117.51,134.11 | 83.67,129.53 83.67,131.37 C15.2 | C19.1 71.53,141.68 71.65,141.8
  Bottom 0.254: v86.66,128.79 84.41,128.79 v84.22,128.97 83.79,129.41 83.77,129.41 83.75,129.43 83.75,141.56 84.52,142.33 v84.95,142.33 84.95,142.86 v83.62,144.19 | v93.55,129.62 93.92,129.25 v95.89,129.25 | v48.79,161.07 48.84,161.02 IC1.25 | 48.44,167.26 47.69,166.5 47.69,165.94 48.09,165.54 48.65,165.54 48.69,165.57 IC1.18 50.81,165.72 51.54,165.72 52.09,166.26 v52.09,167.04 | IC1.21 49.22,163.62 v48.76,163.16 | v45.36,162.84 43.55,162.84 IC1.7 | v122.15,145.43 122.15,133.2 120.81,131.85 120.73,131.93 v120.33,131.93 | v112.49,137.11 114.22,137.11 117.22,134.11 v117.51,134.11 | v116.05,117.64 116.05,123.41 v112.24,127.22
  pour Bottom: -4.14,188.52 53.95,188.52 56.28,186.19 57.54,184.93 57.54,182.23 57.86,181.9 67.18,181.9 69.4,179.68 71.84,177.24 101.26,177.24 102.45,176.05 102.45,171.77 102.45,161.58 104.67,159.36 104.67,153.94 106.14,152.48 122.66,152.48 127.16,147.98 128.3,147.98 140.49,135.78 140.49,115.42 131.45,106.38 -5.5,106.38 -7.13,108.01 -7.13,186.24 -4.88,188.5 -4,188.5
  pour Top: -4.77,188.35 54.62,188.35 54.79,188.19 58.99,183.98 58.99,183.98 58.99,181.71 59.15,181.55 66.6,181.55 66.76,181.71 71.78,176.69 72.59,176.69 101.39,176.69 102.2,177.5 104.63,175.07 104.63,174.42 104.63,154.3 104.91,154.02 106.55,152.38 113.42,152.38 114.36,151.44 123.92,151.44 127.32,148.04 128.28,148.04 131.15,145.17 131.15,144.56 140.89,134.81 141.08,134.81 141.08,115.42 141.54,114.95 132.27,105.68 132.18,105.68 125.91,105.68 124.22,107.37 -6.02,107.37 -6.31,107.08 -6.31,186.78 -4.75,188.34
  pour Top: 86.82,176.54 86.82,184.09 90.6,187.87 112.92,187.87 115.08,190.03 118.06,190.03 124.5,183.58 124.5,172.85 122.17,170.52 92.92,170.52 86.96,176.48
  pour Bottom: 86.74,177.46 86.74,183.91 86.9,184.07 90.86,188.02 90.91,188.02 112.42,188.02 113.34,187.1 113.34,188.35 115.13,190.14 118,190.14 119.52,188.62 124.4,183.74 124.4,183.58 124.56,183.42 124.56,172.96 124.56,172.53 122.17,170.14 93.62,170.14 86.63,177.13
  pour Bottom: 79.97,177.24 79.97,182.88 80.4,183.31 86.58,183.31 87.34,182.55 87.18,182.39 87.18,176.91 86.85,177.24 80.08,177.24
  pour Top: 79.91,177.4 79.91,182.82 80.13,183.04 80.4,183.04 86.2,183.04 86.47,183.31 86.47,175.78 86.69,175.56 81.86,175.56 80.02,177.4
DTR
  Top 0.203: JP4.5 47.88,153.57 48.72,153.57 49.61,152.68 R196.1
  Bottom 0.406: IC1.2 41.03,159.72 36.88,163.87 JP4.5
FORCE1
  Top 0.254: JP9.12 109.61,152.97 100.09,143.45 96.07,143.45 96.02,143.51 U1.24
FORCE2
  Top 0.254: U1.25 99.24,144.01 102.82,147.6 102.82,147.67 107.07,151.93 JP9.14
FORCE3
  Top 0.203: 106.75,157.74 105.71,156.69 105.71,151.5 98.72,144.51 U1.26
  Top 0.254: JP9.11 108.4,157.74 106.75,157.74
FORCE4
  Top 0.203: JP9.13 104.95,156.83 104.95,151.5 98.46,145.01 U1.27
GND  (via drill 0.35)
  Top 0.254: R111.1 57.95,70.57 v56.43,69.05 | v55.28,77.32 IC17.10 | IC17.10 | IC17.10 50.5,77.32 49.54,76.36 49.54,75.21 v49.35,75.03 | v43.93,77.28 43.98,77.32 IC17.5 47.21,77.32 48.14,78.25 48.22,78.17 48.22,79.56 47.92,79.86 IC17.3 | v77.56,80.91 80.85,80.91 IC15.5 82.38,81 82.94,81.55 82.84,81.64 82.84,82.88 82.19,83.54 IC15.3 | v88.66,80.93 86.21,80.93 IC15.10 | v94.75,93.89 94.71,93.85 R99.1 | U4.21 217.74,184.66 v218.58,185.51 | U4.4 221.69,184.66 v220.85,185.51 | U6.4 227.62,104.49 v227.82,104.29 | IC22.3 221.39,71.63 | 221.39,71.63 221.39,69.88 221.52,69.74 221.52,69.28 IC22.12 | IC22.10 IC22.5 218.85,72.91 220.13,71.63 221.39,71.63 | 221.39,71.63 v223.1,71.63 | U7.21 v207.34,113.99 | v207.34,113.99 | v207.39,109.34 207.63,109.1 207.63,106.92 U7.4 | U6.21 227.62,118.58 v227.24,118.96 | IC24.12 174.74,194.05 v174.65,194.14 | IC24.10 177.28,192.74 v177.55,193.01 | IC24.3 174.74,183.94 v174.71,183.91 | IC23.3 271.43,179.16 v271.48,179.11 | IC23.12 271.35,186.72 v271.35,188.85 | IC16.5 45.29,34.98 43.77,34.98 43.08,34.28 v43.08,33.64 | IC16.3 44.01,37.59 43.6,37.18 v43.43,37.18 | IC16.10 48.64,35.05 v48.62,35.02 | C23.1 70.41,186.53 v72.66,186.53 | v72.83,192.25 72.58,192.51 C24.1
  Top 0.406: IC4.3 IC4.4
  Bottom 0.254: v56.43,69.05 56.43,76.18 | 56.43,76.18 v55.28,77.32 | v49.35,75.03 47.1,77.28 v43.93,77.28 | 56.43,76.18 72.83,76.18 v77.56,80.91 88.63,80.91 v88.66,80.93 88.66,86.57 89.39,87.3 89.39,88.52 v94.75,93.89 | v220.85,185.51 v218.58,185.51 | v207.34,113.99 207.34,112.95 206.46,112.07 206.46,110.16 207.29,109.34 v207.39,109.34 | v177.55,193.01 177.55,193.12 | v174.71,183.91 174.67,183.87 174.67,183.52 | v72.66,186.53 72.83,186.7 v72.83,192.25
  pour Top: 1.35,195.05 49.4,195.05 59.5,184.95 59.7,184.76 59.7,182.93 67.76,182.93 68.86,181.83 77.83,181.83 80.37,184.37 85.77,184.37 85.9,184.5 90.52,189.11 93.57,189.11 111.08,189.11 113.74,191.77 118.51,191.77 126.38,183.9 126.38,171.63 126.1,171.35 123.85,169.1 123.47,169.1 111.3,169.1 106.53,164.32 106.53,155.33 107.74,154.11 108.4,153.45 118.88,153.45 126.09,153.45 142.13,137.41 142.13,121.77 142.76,121.14 142.76,111.58 134.43,103.24 7.77,103.24 -6.86,88.62 -6.86,-2.74 -4.99,-4.62 -1.59,-8.01 323.7,-8.01 330.46,-8.01 340.64,2.17 340.64,236.88 327.57,249.95 -0.12,249.95 -11.28,238.8 -11.28,204.7 -1.68,195.1 2.09,195.1
  pour Bottom: -1.21,195.41 -9.88,204.08 -9.88,204.37 -11.28,205.77 -11.28,237.97 3.01,252.26 4.72,252.26 333.69,252.26 359.82,226.13 359.82,-21.14 350.79,-30.17 3.73,-30.17 -5.31,-21.13 -16.35,-10.09 -16.35,85.41 1.26,103.02 8.86,103.02 134.91,103.02 143.31,111.42 144.28,112.4 144.28,122.27 143.96,122.6 143.96,139.93 129.87,154.02 128.59,154.02 107.58,154.02 106.95,154.64 106.95,164.29 111.1,168.44 126.74,168.44 130.52,172.22 130.52,181.67 118.24,193.94 114.2,193.94 110.83,190.57 91.28,190.57 85.61,184.9 59.8,184.9 52.98,191.73 49.68,195.02 49.28,195.02 48.96,195.34 33.66,195.34 -1.12,195.34 -1.23,195.45
INTEG_IN1